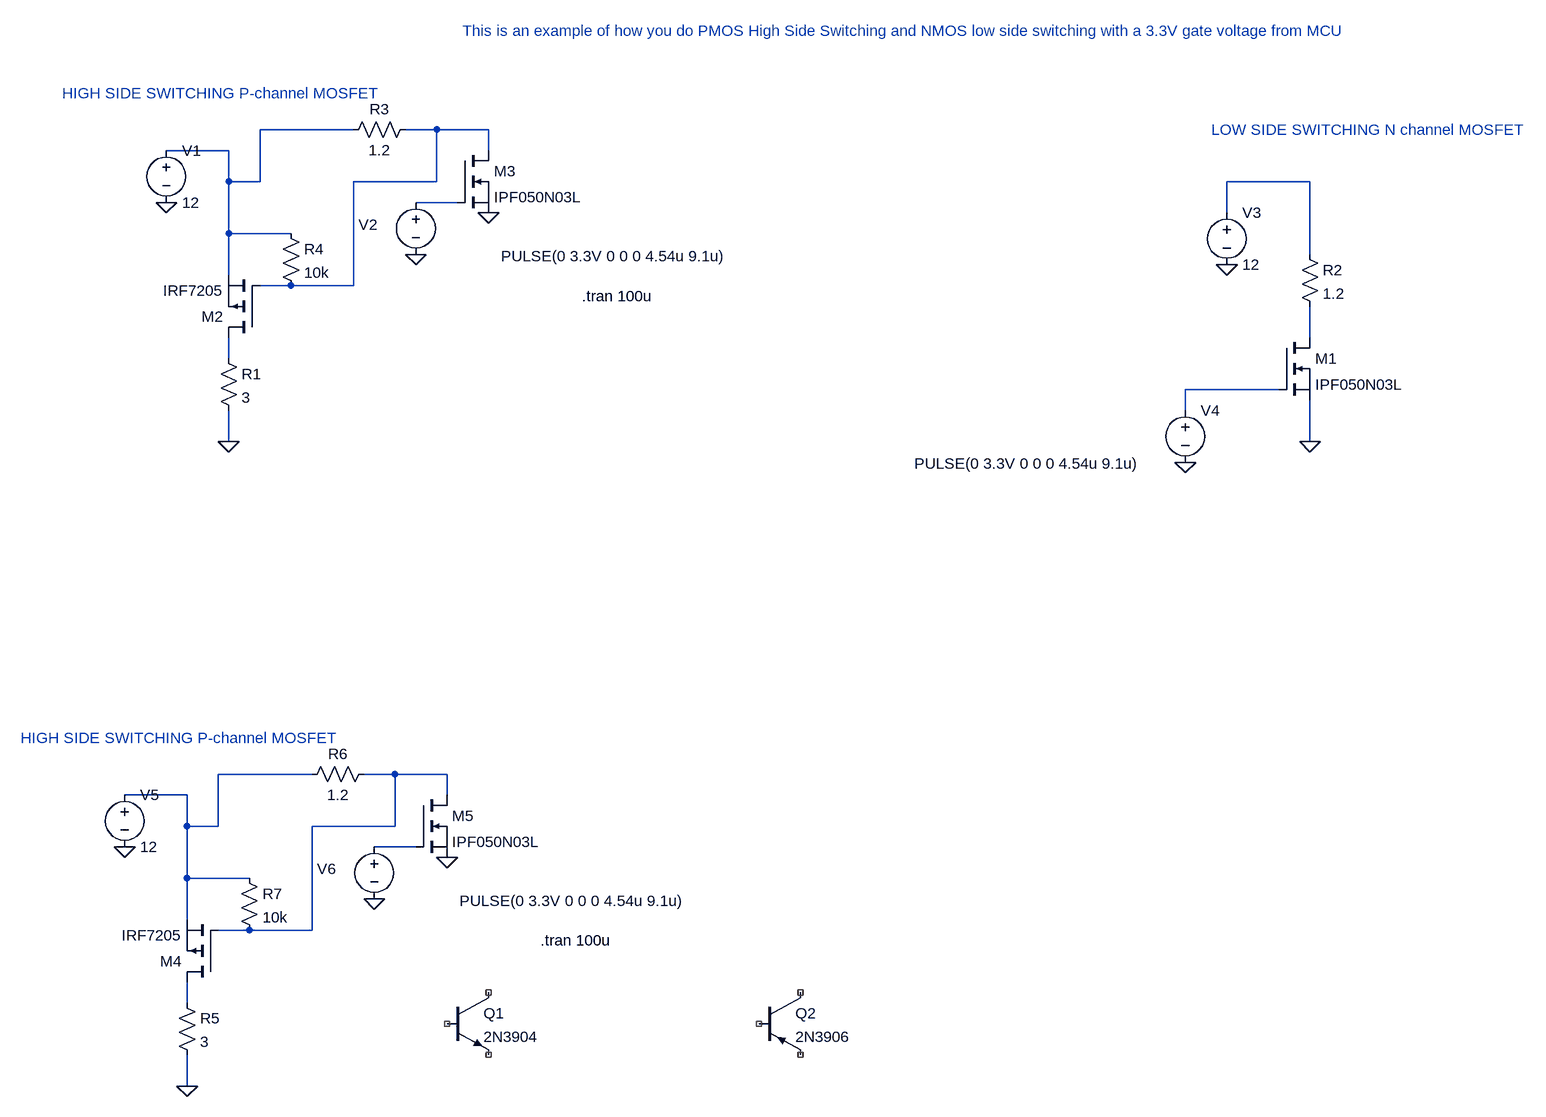
[diagram p0: schematic Draft1.asc]
Draft1.asc, the LTspice schematic file:
Version 4.1
SHEET 1 1656 1268
WIRE -160 -224 -304 -224
WIRE -32 -224 -80 -224
WIRE 48 -224 -32 -224
WIRE -352 -192 -448 -192
WIRE 48 -192 48 -224
WIRE -352 -144 -352 -192
WIRE -304 -144 -304 -224
WIRE -304 -144 -352 -144
WIRE -32 -144 -32 -224
WIRE -32 -144 -160 -144
WIRE 1312 -144 1184 -144
WIRE 0 -112 -64 -112
WIRE 1184 -96 1184 -144
WIRE -352 -64 -352 -144
WIRE -256 -64 -352 -64
WIRE 1312 -32 1312 -144
WIRE -352 0 -352 -64
WIRE -256 16 -304 16
WIRE -160 16 -160 -144
WIRE -160 16 -256 16
WIRE 1312 96 1312 48
WIRE -352 128 -352 96
WIRE 1264 176 1120 176
WIRE 1120 208 1120 176
WIRE -352 256 -352 208
WIRE 1312 256 1312 192
WIRE -224 768 -368 768
WIRE -96 768 -144 768
WIRE -16 768 -96 768
WIRE -416 800 -512 800
WIRE -16 800 -16 768
WIRE -416 848 -416 800
WIRE -368 848 -368 768
WIRE -368 848 -416 848
WIRE -96 848 -96 768
WIRE -96 848 -224 848
WIRE -64 880 -128 880
WIRE -416 928 -416 848
WIRE -320 928 -416 928
WIRE -416 992 -416 928
WIRE -320 1008 -368 1008
WIRE -224 1008 -224 848
WIRE -224 1008 -320 1008
WIRE -416 1120 -416 1088
WIRE -416 1248 -416 1200
FLAG -448 -112 0
FLAG -64 -32 0
FLAG 1184 -16 0
FLAG 1312 256 0
FLAG -352 256 0
FLAG 1120 288 0
FLAG 48 -96 0
FLAG -512 880 0
FLAG -128 960 0
FLAG -416 1248 0
FLAG -16 896 0
SYMBOL nmos 1264 96 R0
SYMATTR InstName M1
SYMATTR Value IPF050N03L
SYMBOL voltage -448 -208 R0
WINDOW 123 0 0 Left 0
WINDOW 39 0 0 Left 0
SYMATTR InstName V1
SYMATTR Value 12
SYMBOL voltage -64 -128 R0
WINDOW 0 -88 50 Left 2
WINDOW 3 131 99 Left 2
WINDOW 123 0 0 Left 0
WINDOW 39 0 0 Left 0
SYMATTR InstName V2
SYMATTR Value PULSE(0 3.3V 0 0 0 4.54u 9.1u)
SYMBOL pmos -304 96 R180
SYMATTR InstName M2
SYMATTR Value IRF7205
SYMBOL res 1296 -48 R0
SYMATTR InstName R2
SYMATTR Value 1.2
SYMBOL voltage 1184 -112 R0
WINDOW 123 0 0 Left 0
WINDOW 39 0 0 Left 0
SYMATTR InstName V3
SYMATTR Value 12
SYMBOL voltage 1120 192 R0
WINDOW 3 -417 98 Left 2
WINDOW 123 0 0 Left 0
WINDOW 39 0 0 Left 0
SYMATTR InstName V4
SYMATTR Value PULSE(0 3.3V 0 0 0 4.54u 9.1u)
SYMBOL res -368 112 R0
SYMATTR InstName R1
SYMATTR Value 3
SYMBOL nmos 0 -192 R0
SYMATTR InstName M3
SYMATTR Value IPF050N03L
SYMBOL res -64 -240 R90
WINDOW 0 0 56 VBottom 2
WINDOW 3 32 56 VTop 2
SYMATTR InstName R3
SYMATTR Value 1.2
SYMBOL res -272 -80 R0
SYMATTR InstName R4
SYMATTR Value 10k
SYMBOL voltage -512 784 R0
WINDOW 123 0 0 Left 0
WINDOW 39 0 0 Left 0
SYMATTR InstName V5
SYMATTR Value 12
SYMBOL voltage -128 864 R0
WINDOW 0 -88 50 Left 2
WINDOW 3 131 99 Left 2
WINDOW 123 0 0 Left 0
WINDOW 39 0 0 Left 0
SYMATTR InstName V6
SYMATTR Value PULSE(0 3.3V 0 0 0 4.54u 9.1u)
SYMBOL pmos -368 1088 R180
SYMATTR InstName M4
SYMATTR Value IRF7205
SYMBOL res -432 1104 R0
SYMATTR InstName R5
SYMATTR Value 3
SYMBOL nmos -64 800 R0
SYMATTR InstName M5
SYMATTR Value IPF050N03L
SYMBOL res -128 752 R90
WINDOW 0 0 56 VBottom 2
WINDOW 3 32 56 VTop 2
SYMATTR InstName R6
SYMATTR Value 1.2
SYMBOL res -336 912 R0
SYMATTR InstName R7
SYMATTR Value 10k
SYMBOL npn -16 1104 R0
SYMATTR InstName Q1
SYMATTR Value 2N3904
SYMBOL pnp 464 1104 R0
SYMATTR InstName Q2
SYMATTR Value 2N3906
TEXT 192 32 Left 2 !.tran 100u
TEXT 1160 -224 Left 2 ;LOW SIDE SWITCHING N channel MOSFET
TEXT -608 -280 Left 2 ;HIGH SIDE SWITCHING P-channel MOSFET
TEXT 8 -376 Left 2 ;This is an example of how you do PMOS High Side Switching and NMOS low side switching with a 3.3V gate voltage from MCU
TEXT 128 1024 Left 2 !.tran 100u
TEXT -672 712 Left 2 ;HIGH SIDE SWITCHING P-channel MOSFET

The netlist it stands for:
* Draft1.asc
M1 N005 N007 0 0 IPF050N03L
V1 N001 0 12
V2 N004 0 PULSE(0 3.3V 0 0 0 4.54u 9.1u)
M2 N006 N002 N001 N001 IRF7205
R2 N003 N005 1.2
V3 N003 0 12
V4 N007 0 PULSE(0 3.3V 0 0 0 4.54u 9.1u)
R1 N006 0 3
M3 N002 N004 0 0 IPF050N03L
R3 N002 N001 1.2
R4 N001 N002 10k
V5 N008 0 12
V6 N010 0 PULSE(0 3.3V 0 0 0 4.54u 9.1u)
M4 N011 N009 N008 N008 IRF7205
R5 N011 0 3
M5 N009 N010 0 0 IPF050N03L
R6 N009 N008 1.2
R7 N008 N009 10k
Q1 NC_01 NC_02 NC_03 0 2N3904
Q2 NC_04 NC_05 NC_06 0 2N3906
.model NPN NPN
.model PNP PNP
.lib standard.bjt
.model NMOS NMOS
.model PMOS PMOS
.lib standard.mos
.tran 100u
* LOW SIDE SWITCHING N channel MOSFET
* HIGH SIDE SWITCHING P-channel MOSFET
* This is an example of how you do PMOS High Side Switching and NMOS low side switching with a 3.3V gate voltage from MCU
.tran 100u
* HIGH SIDE SWITCHING P-channel MOSFET
.backanno
.end